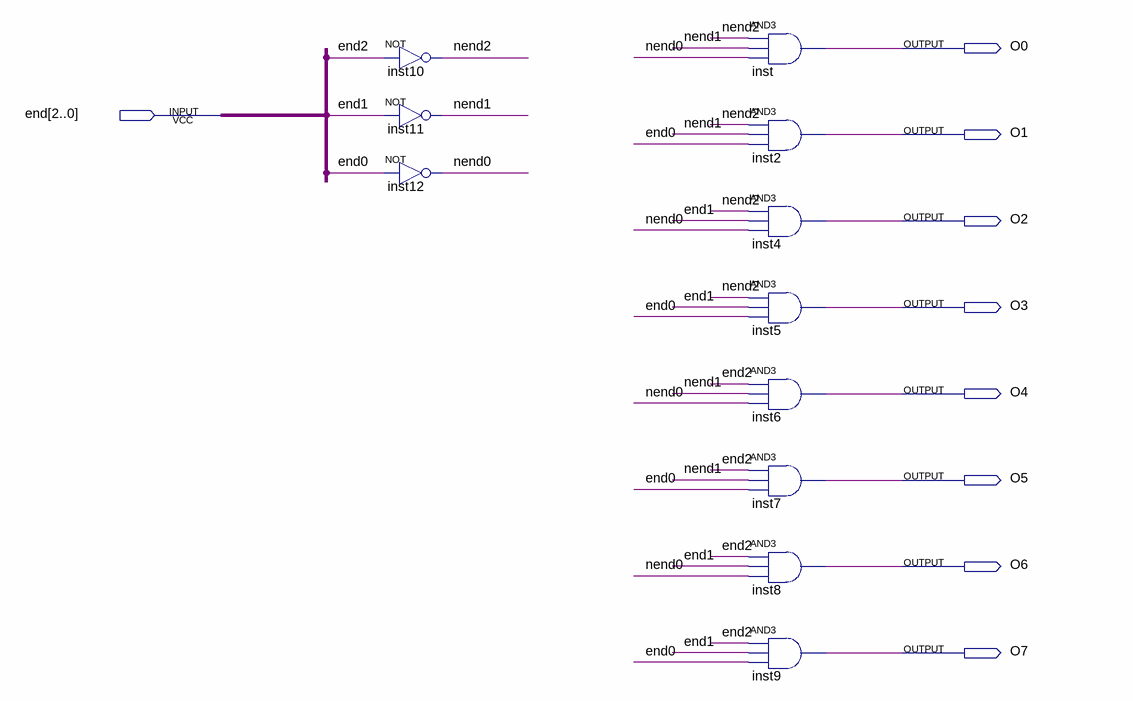
[diagram p0: schematic sheet]
// Quartus schematic decodificador.bdf as structural Verilog: 11 symbols, 9 pins
module decodificador (
  input  [2:0] \end ,
  output O0,
  output O1,
  output O2,
  output O3,
  output O4,
  output O5,
  output O6,
  output O7
);

  wire nend0, nend1, nend2;

  not inst10 (nend2, \end [2]);
  not inst11 (nend1, \end [1]);
  not inst12 (nend0, \end [0]);
  and inst (O0, nend2, nend1, nend0);
  and inst2 (O1, nend2, nend1, \end [0]);
  and inst4 (O2, nend2, \end [1], nend0);
  and inst5 (O3, nend2, \end [1], \end [0]);
  and inst6 (O4, \end [2], nend1, nend0);
  and inst7 (O5, \end [2], nend1, \end [0]);
  and inst8 (O6, \end [2], \end [1], nend0);
  and inst9 (O7, \end [2], \end [1], \end [0]);
endmodule
